# EAGLE schematic Boost_v3 (EAGLE 9.6.2)
Boost configuración 1
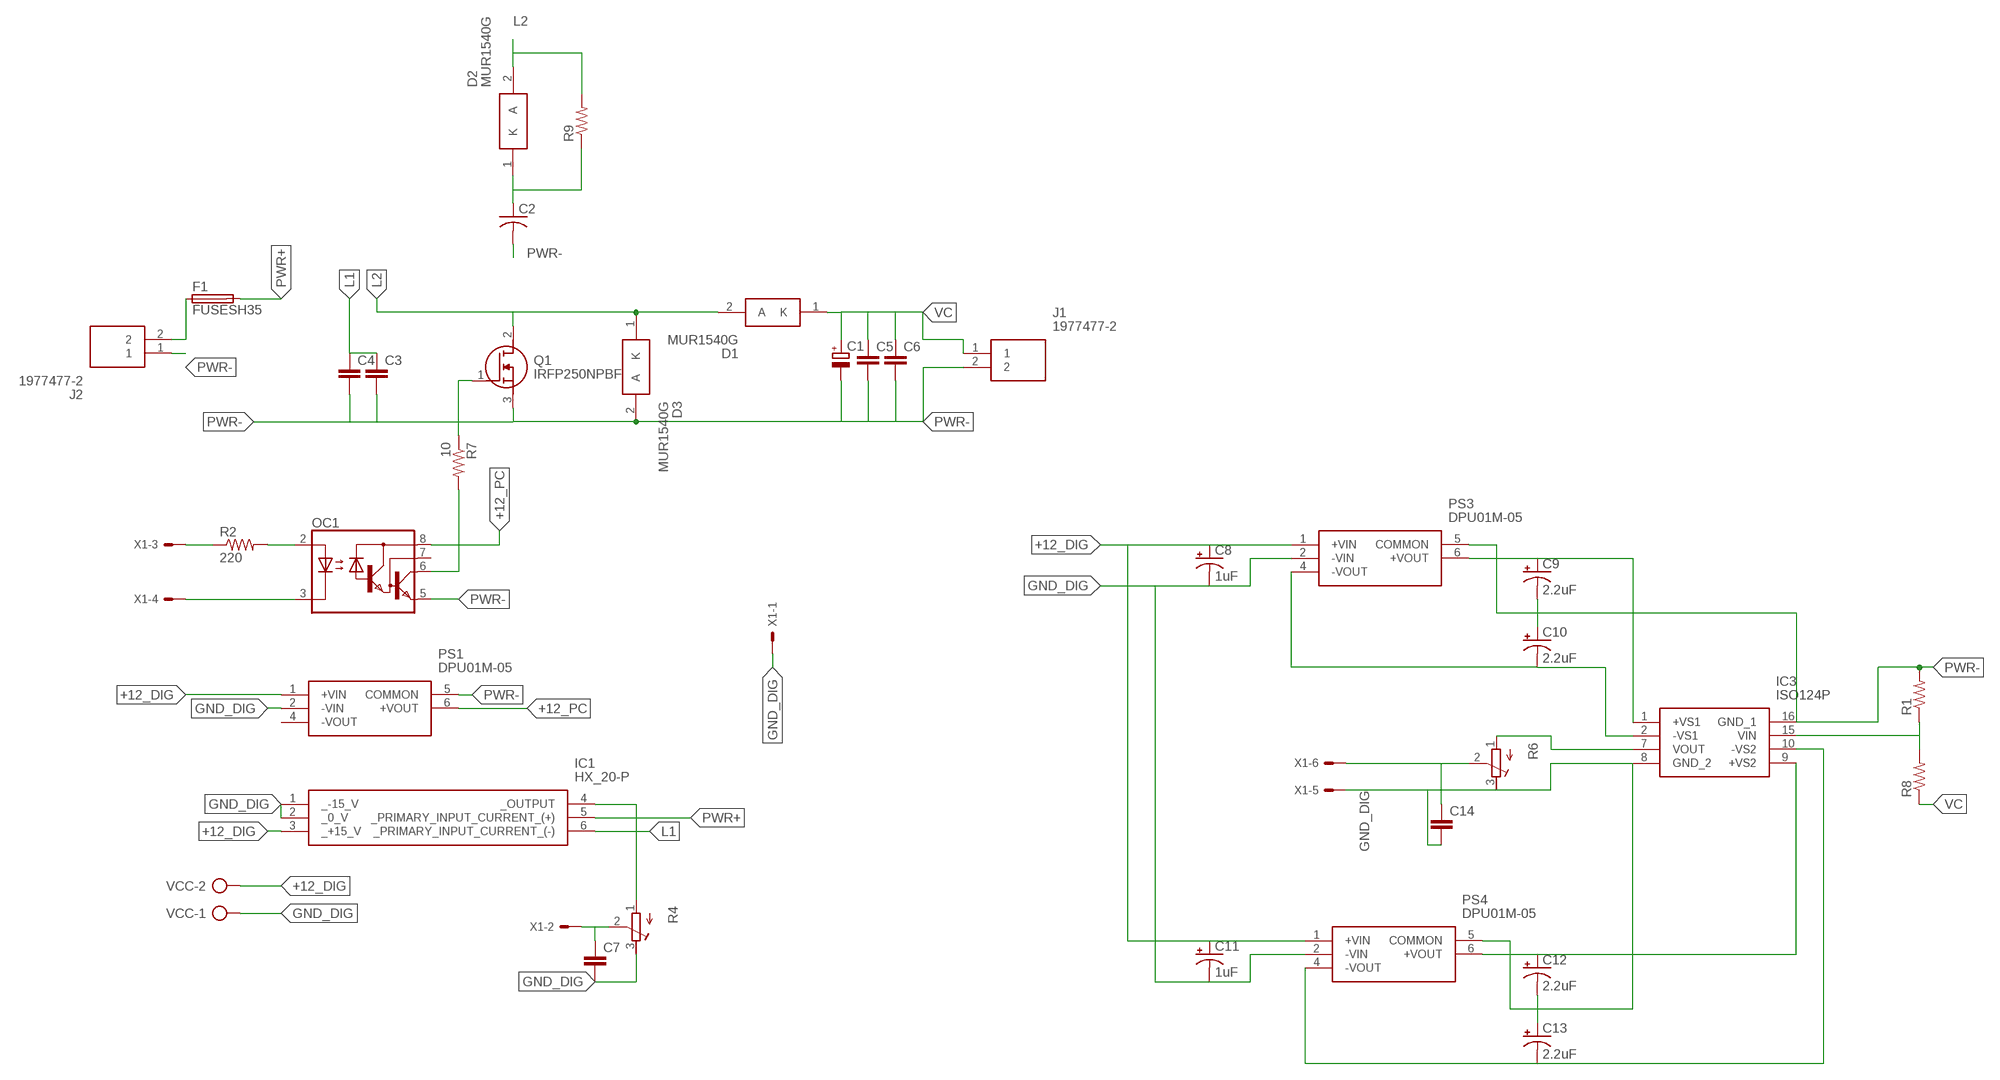
[diagram p0: schematic, sheet 1]

## Parts
C1  CPOL-EUE10-35  [EB35D]
C2  C-US050-025X075  [C050-025X075]
C3  C-EU050-030X075  [C050-030X075]
C4  C-EU050-030X075  [C050-030X075]
C5  C-EU050-030X075  [C050-030X075]
C6  C-EU050-030X075  [C050-030X075]
C7  C-EU050-030X075  [C050-030X075]
C8  1uF  CPOL-USE2.5-5  [E2,5-5]
C9  2.2uF  CPOL-USE2.5-5  [E2,5-5]
C10  2.2uF  CPOL-USE2.5-5  [E2,5-5]
C11  1uF  CPOL-USE2.5-5  [E2,5-5]
C12  2.2uF  CPOL-USE2.5-5  [E2,5-5]
C13  2.2uF  CPOL-USE2.5-5  [E2,5-5]
C14  C-EU050-030X075  [C050-030X075]
D1  MUR1540G  [TO533P482X997X1956-2P]
D2  MUR1540G  [TO533P482X997X1956-2P]
D3  MUR1540G  [TO533P482X997X1956-2P]
F1  FUSESH35  [SH25]
IC1  HX_20-P  [HX20P]
IC3  ISO124P  [DIP254P762X533-8P]
J1  1977477-2  [SHDR2W165P0X825_1X2_1650X1370X]
J2  1977477-2  [SHDR2W165P0X825_1X2_1650X1370X]
OC1  6N138  [DIL08]
PS1  DPU01M-05  [DPU01M05]
PS3  DPU01M-05  [DPU01M05]
PS4  DPU01M-05  [DPU01M05]
Q1  IRFP250NPBF  [TO545P530X1560X2460-3P]
R1  R-US_VTA52  [VTA52]
R2  220  R-US_0207/10  [0207/10]
R4  R-TRIMM64W  [RTRIM64W]
R6  R-TRIMM64W  [RTRIM64W]
R7  10  R-US_0207/10  [0207/10]
R8  R-US_VTA52  [VTA52]
R9  R-US_VTA52  [VTA52]
VCC  AK500/2  [AK500/2]
X1  22-23-2061  [22-23-2061]

## Nets
+12_DIG: C8.+ C11.+ IC1.3(_+15_V) PS1.1(+VIN) PS3.1(+VIN) PS4.1(+VIN) VCC.2
+12_PC: OC1.8(VCC) PS1.6(+VOUT)
GND_DIG: C7.2 C8.- C11.- C12.- C13.+ C14.2 IC1.1(_-15_V) IC1.2(_0_V) IC3.8(GND_2) PS1.2(-VIN) PS3.2(-VIN) PS4.2(-VIN) PS4.5(COMMON) R4.3(E) R6.3(E) VCC.1 X1.1 X1.5
L1: C3.1 C4.1 IC1.6(_PRIMARY_INPUT_CURRENT_(-))
L2: D1.2(A) D2.2(A) D3.1(K) Q1.2(D) R9.2
N$1: OC1.2(A) R2.2
N$2: Q1.1(G) R7.1
N$3: C7.1 R4.2(S) X1.2
N$4: C2.1 D2.1(K) R9.1
N$6: OC1.6(VO) R7.2
N$7: R2.1 X1.3
N$8: OC1.3(C) X1.4
N$9: C14.1 R6.2(S) X1.6
N$10: IC1.4(_OUTPUT) R4.1(A)
N$14: F1.1 J2.2
N$17: C9.+ IC3.1(+VS1) PS3.6(+VOUT)
N$18: C10.- IC3.2(-VS1) PS3.4(-VOUT)
N$19: C12.+ IC3.9(+VS2) PS4.6(+VOUT)
N$20: C13.- IC3.10(-VS2) PS4.4(-VOUT)
N$23: IC3.15(VIN) R1.1 R8.2
N$24: IC3.7(VOUT) R6.1(A)
PWR+: F1.2 IC1.5(_PRIMARY_INPUT_CURRENT_(+))
PWR-: C1.- C2.2 C3.2 C4.2 C5.2 C6.2 C9.- C10.+ D3.2(A) IC3.16(GND_1) J1.2 J2.1 OC1.5(GND) PS1.5(COMMON) PS3.5(COMMON) Q1.3(S) R1.2
VC: C1.+ C5.1 C6.1 D1.1(K) J1.1 R8.1
Unconnected: OC1.7(VB) PS1.4(-VOUT)

## Library data of the parts
C1 = rcl:CPOL-EU: POLARIZED CAPACITOR, European symbol; SPICEPREFIX: C
C2 = rcl:C-US: CAPACITOR, American symbol; SPICEPREFIX: C
C3-C7 C14 = rcl:C-EU: CAPACITOR, European symbol; SPICEPREFIX: C
C8-C13 = rcl:CPOL-US: POLARIZED CAPACITOR, American symbol; SPICEPREFIX: C
D1-D3 = SamacSys_Parts:MUR1540G: Source: Datasheet <http://www.onsemi.com/pub/Collateral/MUR1520-D.PDF>; ALLIED_NUMBER: 70100054; ALLIED_PRICE-STOCK: http://www.alliedelec.com/on-semiconductor-mur1540g/70100054/; HEIGHT: 4.82mm; MANUFACTURER_NAME: ON Semiconductor; MANUFACTURER_PART_NUMBER: MUR1540G; MOUSER_PART_NUMBER: 863-MUR1540G; MOUSER_PRICE-STOCK: https://www.mouser.com/Search/Refine.aspx?Keyword=863-MUR1540G; RS_PART_NUMBER: 5449567P; RS_PRICE-STOCK: http://uk.rs-online.com/web/p/products/5449567P
F1 = fuse:FUSE: Fuse; OC_FARNELL: unknown; OC_NEWARK: unknown
IC1 = SamacSys_Parts:HX_20-P: SENSOR CURRENT HALL 20A AC/DC Source: Datasheet <https://media.digikey.com/pdf/Data Sheets/LEM USA PDFs/HX 3-50-P.pdf>; DESCRIPTION: SENSOR CURRENT HALL 20A AC/DC; HEIGHT: 20mm; MANUFACTURER_NAME: LEM; MANUFACTURER_PART_NUMBER: HX 20-P
IC3 = ISO124P:ISO124P: Isolating amplifier,ISO124P DIP16 1500V Source: Datasheet <http://componentsearchengine.com/Datasheets/1/ISO124P.pdf>; DESCRIPTION: Isolating amplifier,ISO124P DIP16 1500V; HEIGHT: mm; MANUFACTURER_NAME: Texas Instruments; MANUFACTURER_PART_NUMBER: ISO124P; MOUSER_PART_NUMBER: 595-ISO124P; MOUSER_PRICE-STOCK: https://www.mouser.com/Search/Refine.aspx?Keyword=595-ISO124P; RS_PART_NUMBER: 3008243P; RS_PRICE-STOCK: http://uk.rs-online.com/web/p/products/3008243P
J1 J2 = SamacSys_Parts:1977477-2: Barrier Terminal Blocks DUAL 2 POS .325 BLK Source: Datasheet <http://www.mouser.com/ds/2/418/NG_CD_1977477_B1-621264.pdf>; ALLIED_NUMBER: 70248678; ALLIED_PRICE-STOCK: https://www.alliedelec.com/te-connectivity-1977477-2/70248678/; DESCRIPTION: Barrier Terminal Blocks DUAL 2 POS .325 BLK; HEIGHT: 15.1mm; MANUFACTURER_NAME: TE CONNECTIVITY / BUCHANAN; MANUFACTURER_PART_NUMBER: 1977477-2; MOUSER_PART_NUMBER: 571-1977477-2; MOUSER_PRICE-STOCK: https://www.mouser.com/Search/Refine.aspx?Keyword=571-1977477-2
OC1 = optocoupler:6N138: MOTOROLA OPTO COUPLER
PS1 PS3 PS4 = DPU01M-05:DPU01M-05: Isolated DC/DC Converters 10.8-13.2Vin +/-5V +/-100mA SIP6 Unreg Source: Datasheet <https://media.digikey.com/pdf/Data Sheets/Mean Well PDF>; DESCRIPTION: Isolated DC/DC Converters 10.8-13.2Vin +/-5V +/-100mA SIP6 Unreg; HEIGHT: 10.45mm; MANUFACTURER_NAME: Mean Well; MANUFACTURER_PART_NUMBER: DPU01M-05; MOUSER_PART_NUMBER: 709-DPU01M-05; MOUSER_PRICE-STOCK: https://www.mouser.com/Search/Refine.aspx?Keyword=709-DPU01M-05
Q1 = SamacSys_Parts:IRFP250NPBF: MOSFET N-Channel 200V 30A TO247AC Infineon IRFP250NPBF N-channel MOSFET Transistor, 30 A, 200 V, 3-Pin TO-247AC Source: Datasheet <https://componentsearchengine.com/Datasheets/1/IRFP250NPBF.pdf>; DESCRIPTION: MOSFET N-Channel 200V 30A TO247AC Infineon IRFP250NPBF N-channel MOSFET Transistor, 30 A, 200 V, 3-Pin TO-247AC; HEIGHT: 5.3mm; MANUFACTURER_NAME: Infineon; MANUFACTURER_PART_NUMBER: IRFP250NPBF; MOUSER_PART_NUMBER: 942-IRFP250NPBF; MOUSER_PRICE-STOCK: https://www.mouser.com/Search/Refine.aspx?Keyword=942-IRFP250NPBF
R1 R2 R7-R9 = rcl:R-US_: RESISTOR, American symbol; SPICEPREFIX: R
R4 R6 = rcl:R-TRIMM: Trimm resistor; SPICEMODEL: X; SPICEPREFIXL: POT
VCC = con-ptr500:AK500/2: CONNECTOR; OC_FARNELL: unknown; OC_NEWARK: unknown
X1 = con-molex:22-23-2061: .100" (2.54mm) Center Header - 6 Pin; MF: MOLEX; MPN: 22-23-2061; OC_FARNELL: 1462922; OC_NEWARK: 27C1933